# Altium project PCB_TramHanSTM8S.PrjPcb
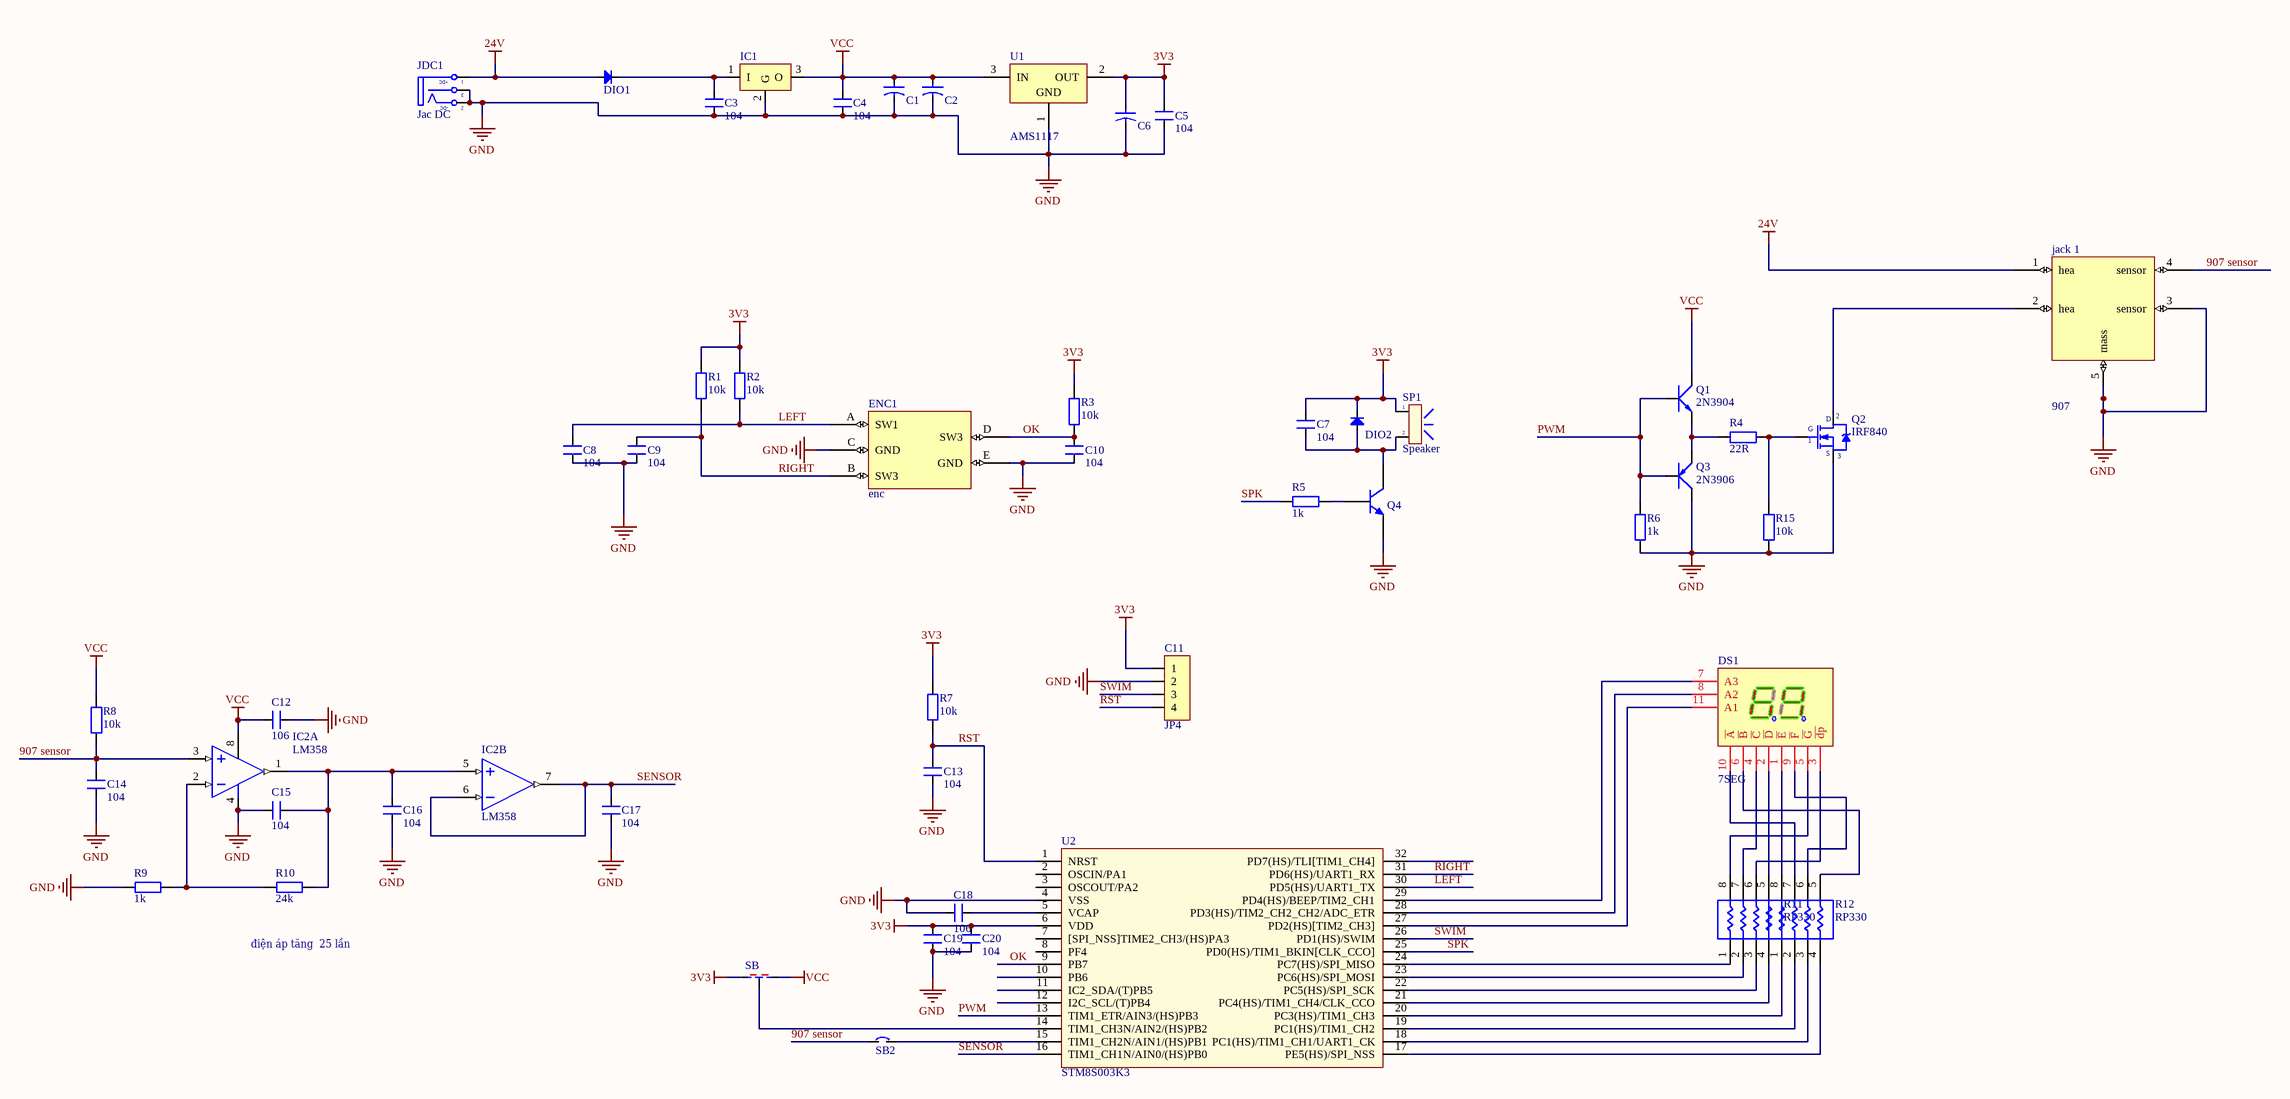
[diagram p0: TramHanSTM8.SchDoc]
1 sheet, 50 parts. Net scope: global (net labels, ports and power ports of the same name join across sheets).
Board files: TramHanSTM8S_V1.PcbDoc, TramHanSTM8S_V2_HOAN_TAT.PcbDoc, MICA PCB.PcbDoc, CAT_MICA.PcbDoc, HanCam.PcbDoc, TramHanSTM8.PcbDoc

## Sheet TramHanSTM8.SchDoc
size A2

### Parts
C1  CAP  [C 1206]  (value not drawn)
C2  CAP  [C 1206]  (value not drawn)
C3  104  [SM-0805]
C4  104  [SM-0805]
C5  104  [SM-0805]
C6  CAP  [C 1206]  (value not drawn)
C7  104  [SM-0805]
C8  104  [SM-0805]
C9  104  [SM-0805]
C10  104  [SM-0805]
C11  JP4  [JP4-C1T]
C12  106  [SM-0805]
C13  104  [SM-0805]
C14  104  [SM-0805]
C15  104  [SM-0805]
C16  104  [SM-0805]
C17  104  [SM-0805]
C18  106  [SM-0805]
C19  104  [SM-0805]
C20  104  [SM-0805]
DIO1  Diode SMD  [DIO-SMD-106]  (value not drawn)
DIO2  Diode SMD  [DIO-SMD-106]  (value not drawn)
DS1  7SEG  [LED 7 SEG 3 DIGIT]
ENC1  enc  [ENC]
IC1  LM7805 SOT89  [SOT89-321]  (value not drawn)
IC2  LM358  [SO8]  (parts A,B of 2)
jack_1  907  [jack 907]
JDC1  Jac DC  [DC0]
Q1  2N3904  [SOT23-231]
Q2  IRF840  [TO252-123]
Q3  2N3906  [SOT23-231]
Q4  C1815  [SOT 23]  (value not drawn)
R1  10k  [SM-RES-0805]
R2  10k  [SM-RES-0805]
R3  10k  [SM-RES-0805]
R4  22R  [SM-RES-0805]
R5  1k  [SM-RES-0805]
R6  1k  [SM-RES-0805]
R7  10k  [SM-RES-0805]
R8  10k  [SM-RES-0805]
R9  1k  [SM-RES-0805]
R10  24k  [SM-RES-0805]
R11  RP330  [RESCAXS50P160X320X70-8N]
R12  RP330  [RESCAXS50P160X320X70-8N]
R15  10k  [SM-RES-0805]
SB  (no value)  [SB_3]
SB2  SB  [SB]  (value not drawn)
SP1  Speaker  [SPEAKER]
U1  AMS1117  [SOT 223]
U2  STM8S003K3  [TQFP32]

### Nets
3V3: C5.2 C6.1 C7.1 C11.1 C19.1 C20.1 DIO2.2(K) R1.2 R2.2 R3.2 R7.1 SB.1 SP1.1 U1.2(OUT) U2.6(VDD)
24V: DIO1.1(A) jack_1.1(hea) JDC1.1(T)
GND: C1.2 C2.2 C3.1 C4.1 C5.1 C6.2 C8.2 C9.2 C10.2 C11.2 C12.1 C13.1 C14.1 C15.2 C16.2 C17.2 C18.2 C19.2 C20.2 ENC1.C(GND) ENC1.E(GND) IC1.2(G) IC2.4(-V) jack_1.3(sensor) jack_1.5(mass) JDC1.2(TN) JDC1.3(S) Q2.3(S) Q3.3(C) Q4.2(E) R6.1 R9.2 R15.1 U1.1(GND) U2.4(VSS)
VCC: C1.1 C2.1 C4.2 C12.2 IC1.3(O) IC2.8(+V) Q1.3(C) R8.1 SB.3 U1.3(IN)
907 sensor: C14.2 IC2.3(IN+) jack_1.4(sensor) R8.2 SB2.1
LEFT: C8.1 ENC1.A(SW1) R2.1 U2.30(PD5(HS)/UART1_TX)
OK: C10.1 ENC1.D(SW3) R3.1 U2.9(PB7)
PWM: Q1.2(B) Q3.2(B) R6.2 U2.13(TIM1_ETR/AIN3/(HS)PB3)
RIGHT: C9.1 ENC1.B(SW3) R1.1 U2.31(PD6(HS)/UART1_RX)
RST: C11.4 C13.2 R7.2 U2.1(NRST)
SENSOR: C17.1 IC2.6(IN-) IC2.7(OUT) U2.16(TIM1_CH1N/AIN0/(HS)PB0)
SPK: R5.1 U2.25(PD0(HS)/TIM1_BKIN[CLK_CCO])
SWIM: C11.3 U2.26(PD1(HS)/SWIM)
NetC3_2: C3.2 DIO1.2(K) IC1.1(I)
NetC7_2: C7.2 DIO2.1(A) Q4.3(C) SP1.2
NetC15_1: C15.1 C16.1 IC2.1(OUT) IC2.5(IN+) R10.1
NetC18_1: C18.1 U2.5(VCAP)
NetDS1_1: DS1.1(~{E}) R12.8
NetDS1_2: DS1.2(~{D}) R11.5
NetDS1_3: DS1.3(~{dp}) R11.6
NetDS1_4: DS1.4(~{C}) R11.7
NetDS1_5: DS1.5(~{G}) R11.8
NetDS1_6: DS1.6(~{B}) R12.5
NetDS1_7: DS1.7(A3) U2.29(PD4(HS)/BEEP/TIM2_CH1)
NetDS1_8: DS1.8(A2) U2.28(PD3(HS)/TIM2_CH2_CH2/ADC_ETR)
NetDS1_9: DS1.9(~{F}) R12.6
NetDS1_10: DS1.10(~{A}) R12.7
NetDS1_11: DS1.11(A1) U2.27(PD2(HS)[TIM2_CH3])
NetIC2_2: IC2.2(IN-) R9.1 R10.2
Netjack_1_2: jack_1.2(hea) Q2.2(D)
NetQ1_1: Q1.1(E) Q3.1(E) R4.2
NetQ2_1: Q2.1(G) R4.1 R15.2
NetQ4_1: Q4.1(B) R5.2
NetR11_1: R11.1 U2.24(PC7(HS)/SPI_MISO)
NetR11_2: R11.2 U2.23(PC6(HS)/SPI_MOSI)
NetR11_3: R11.3 U2.22(PC5(HS)/SPI_SCK)
NetR11_4: R11.4 U2.21(PC4(HS)/TIM1_CH4/CLK_CCO)
NetR12_1: R12.1 U2.20(PC3(HS)/TIM1_CH3)
NetR12_2: R12.2 U2.19(PC1(HS)/TIM1_CH2)
NetR12_3: R12.3 U2.18(PC1(HS)/TIM1_CH1/UART1_CK)
NetR12_4: R12.4 U2.17(PE5(HS)/SPI_NSS)
NetSB2_2: SB2.2 U2.15(TIM1_CH2N/AIN1/(HS)PB1)
NetSB_2: SB.2 U2.14(TIM1_CH3N/AIN2/(HS)PB2)

Not connected (* = marked no-connect by the designer): U2 2(OSCIN/PA1) 3(OSCOUT/PA2) 7([SPI_NSS]TIME2_CH3/(HS)PA3) 8(PF4) 10(PB6) 11(IC2_SDA/(T)PB5) 12(I2C_SCL/(T)PB4) 32(PD7(HS)/TLI[TIM1_CH4])

### Notes on the sheet
- điện áp tăng  25 lần
- (in symbol DCIN) +DC; -DC

### Library data of the parts
C1 C2 C6 = CAP: Value: *uF
C3-C5 C7-C10 C12-C20 = CM: Cap SMD; Value: 103
C11 = JP4: WR-PHD 2.54 mm Angled Socket Header; Manufacturer: W¨¹rth Elektronik eiSos GmbH; partNo: 613004143121; ComponentLink1 Description: Manufacturer; ComponentLink2 Description: Datasheet; NoPins: 04; Created Date: 29 March 2013; ComponentLink1URL: http://www.we-online.com; ComponentLink2URL: http://katalog.we-online.de/em/datasheet/6130xx143121.pdf; Created by: Karrer Zheng
DIO1 DIO2 = Diode SMD: Default Diode; Code - JEDEC: DO-214-AB; Value: 1N5007; Published: 8-Jun-2000; Revision: July-2002: Re-released for DXP Platform.; Publisher: Altium Limited
DS1 = LED 7 SEG 3 DIGIT
IC1 = LM78xx: Positive Voltage Regulator; Note: Tab is connected to pin 3 (GND).; Published: 24-Aug-2001; LatestRevisionDate: 17-Jul-2002; LatestRevisionNote: Re-released for DXP Platform.; DatasheetVersion: Apr-1994; PackageVersion: Jul-1998; PackageReference: ISOWATT220AB; Publisher: Altium Limited; PackageDescription: TO, Thru-Hole, Vertical, Heatsink Mounted; 3 In-Line Leads; Pitch 2.54 mm; Pin sequence 1, 3, 2; ComponentLink1Description: Manufacturer Link; ComponentLink1URL: http://www.st.com/; ComponentLink2Description: Datasheet; ComponentLink2URL: http://www.st.com/stonline/products/literature/ds/2146/l78m05c.pdf
IC2 = LM358: Low-Power Dual Operational Amplifier; Value: LM358
jack_1 = jack 907
JDC1 = DCIN: Jac DC input; Value: Jac DC
Q1 = 2N904: NPN 600mW, ECB; Value: C1815
Q2 = IRF840: MOSFET N - CHANNEL 500V - 0.75 - 8A - TO-220; Value: IRF840
Q3 = 2N3906: PNP 600mW, ECB; Value: A1015
Q4 = C1815_SMD
R1-R10 R15 = R1/4W: Resistor 1/4W; Value: R1/4W - 1K
R11 R12 = ResPack
SB = SB_3
SP1 = SPK: Speaker Chip; Value: Speaker Chip
U1 = AMS117
U2 = STM8S003K3: MCU 8BIT  8KB FLASH LQFP-32